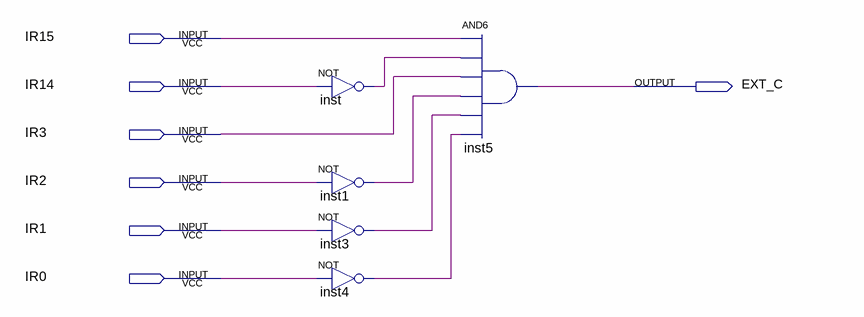
[diagram p0: schematic sheet]
// Quartus schematic EXT_C.bdf as structural Verilog: 5 symbols, 7 pins
module EXT_C (
  input  IR15,
  input  IR14,
  input  IR3,
  input  IR2,
  input  IR1,
  input  IR0,
  output EXT_C
);

  wire inst1_out, inst3_out, inst4_out, inst_out;

  not inst (inst_out, IR14);
  not inst1 (inst1_out, IR2);
  not inst3 (inst3_out, IR1);
  not inst4 (inst4_out, IR0);
  and inst5 (EXT_C, IR15, inst_out, IR3, inst1_out, inst3_out, inst4_out);
endmodule
